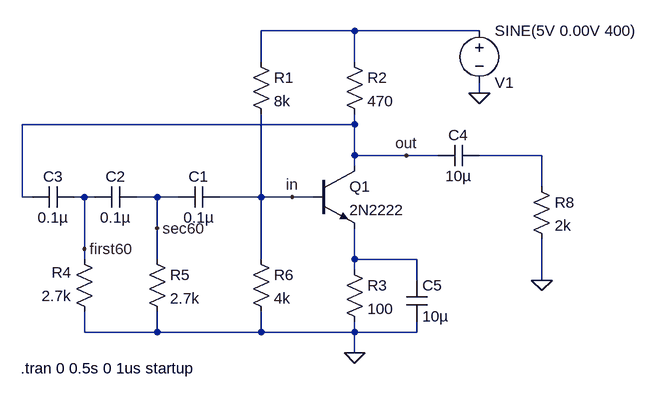
[diagram p0: schematic PhaseShiftOscillator.asc]
PhaseShiftOscillator.asc, the LTspice schematic file:
Version 4
SHEET 1 880 680
WIRE 288 -48 144 -48
WIRE 480 -48 288 -48
WIRE 144 0 144 -48
WIRE 288 0 288 -48
WIRE 480 48 480 32
WIRE 288 96 288 80
WIRE 288 96 -224 96
WIRE 288 144 288 96
WIRE 368 144 288 144
WIRE 416 144 368 144
WIRE 576 144 480 144
WIRE 288 160 288 144
WIRE 576 192 576 144
WIRE -224 208 -224 96
WIRE -208 208 -224 208
WIRE -128 208 -144 208
WIRE -112 208 -128 208
WIRE -16 208 -48 208
WIRE 16 208 -16 208
WIRE 144 208 144 80
WIRE 144 208 80 208
WIRE 192 208 144 208
WIRE 224 208 192 208
WIRE -16 256 -16 208
WIRE -128 288 -128 208
WIRE -128 304 -128 288
WIRE -16 304 -16 256
WIRE 144 304 144 208
WIRE 288 304 288 256
WIRE 384 304 288 304
WIRE 288 320 288 304
WIRE 384 336 384 304
WIRE 576 336 576 272
WIRE -128 416 -128 384
WIRE -16 416 -16 384
WIRE -16 416 -128 416
WIRE 144 416 144 384
WIRE 144 416 -16 416
WIRE 288 416 288 400
WIRE 288 416 144 416
WIRE 384 416 384 400
WIRE 384 416 288 416
WIRE 288 448 288 416
FLAG 576 336 0
FLAG 288 448 0
FLAG 368 144 out
FLAG 192 208 in
FLAG -128 288 first60
FLAG -16 256 sec60
FLAG 480 48 0
SYMBOL npn 224 160 R0
SYMATTR InstName Q1
SYMATTR Value 2N2222
SYMBOL res 128 -16 R0
SYMATTR InstName R1
SYMATTR Value 8k
SYMBOL res 272 -16 R0
SYMATTR InstName R2
SYMATTR Value 470
SYMBOL res 272 304 R0
SYMATTR InstName R3
SYMATTR Value 100
SYMBOL res -112 400 R180
WINDOW 0 36 76 Left 2
WINDOW 3 36 40 Left 2
SYMATTR InstName R4
SYMATTR Value 2.7k
SYMBOL res 560 176 R0
SYMATTR InstName R8
SYMATTR Value 2k
SYMBOL cap 480 128 R90
WINDOW 0 0 32 VBottom 2
WINDOW 3 32 32 VTop 2
SYMATTR InstName C4
SYMATTR Value 10µ
SYMBOL voltage 480 -64 R0
WINDOW 0 24 96 Left 2
WINDOW 3 24 16 Left 2
WINDOW 123 0 0 Left 0
WINDOW 39 0 0 Left 0
SYMATTR InstName V1
SYMATTR Value SINE(5V 0.00V 400)
SYMBOL cap 368 336 R0
SYMATTR InstName C5
SYMATTR Value 10µ
SYMBOL cap 80 192 R90
WINDOW 0 0 32 VBottom 2
WINDOW 3 32 32 VTop 2
SYMATTR InstName C1
SYMATTR Value 0.1µ
SYMBOL cap -48 192 R90
WINDOW 0 0 32 VBottom 2
WINDOW 3 32 32 VTop 2
SYMATTR InstName C2
SYMATTR Value 0.1µ
SYMBOL res -32 288 R0
SYMATTR InstName R5
SYMATTR Value 2.7k
SYMBOL res 128 288 R0
SYMATTR InstName R6
SYMATTR Value 4k
SYMBOL cap -144 192 R90
WINDOW 0 0 32 VBottom 2
WINDOW 3 32 32 VTop 2
SYMATTR InstName C3
SYMATTR Value 0.1µ
TEXT -226 472 Left 2 !.tran 0 0.5s 0 1us startup

The netlist it stands for:
* PhaseShiftOscillator.asc
Q1 out in N003 0 2N2222
R1 N001 in 8k
R2 N001 out 470
R3 N003 0 100
R4 0 first60 2.7k
R8 N002 0 2k
C4 N002 out 10µ
V1 N001 0 SINE(5V 0.00V 400)
C5 N003 0 10µ
C1 in sec60 0.1µ
C2 sec60 first60 0.1µ
R5 sec60 0 2.7k
R6 in 0 4k
C3 first60 out 0.1µ
.model NPN NPN
.model PNP PNP
.lib standard.bjt
.tran 0 0.5s 0 1us startup
.backanno
.end